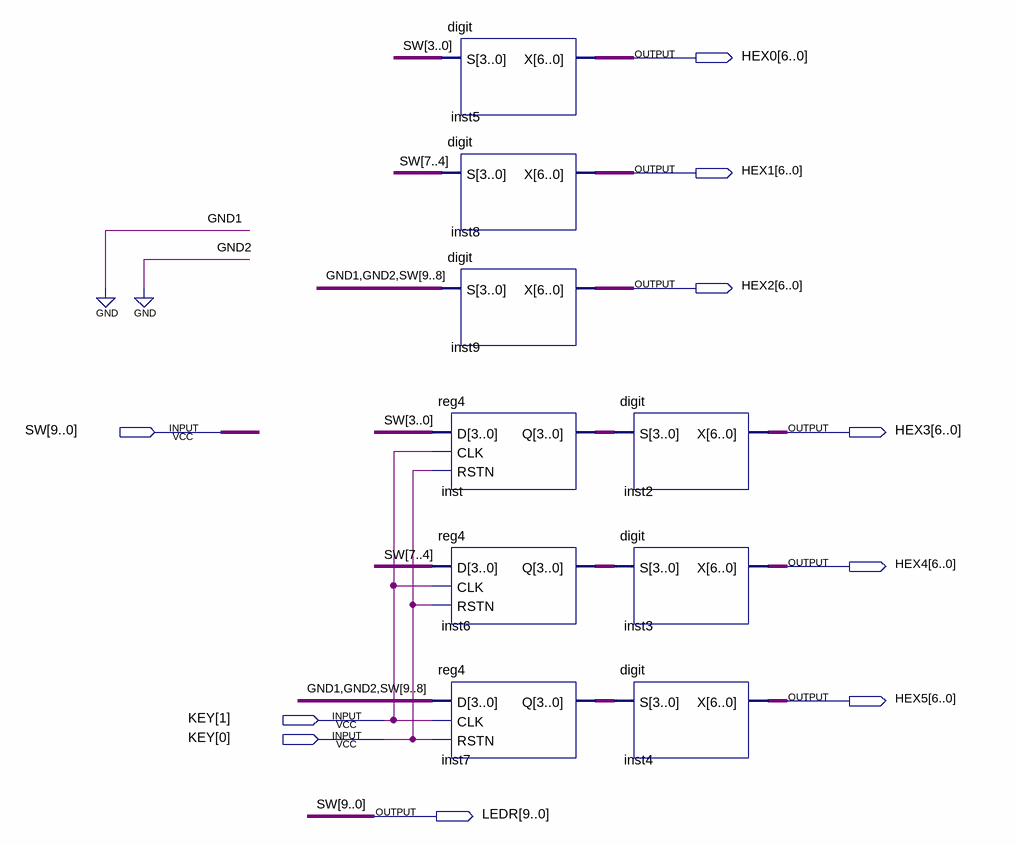
[diagram p0: schematic sheet]
// Quartus schematic part_d.bdf as structural Verilog: 9 symbols, 10 pins
module part_d (
  input  [9:0] SW,
  input  [1:0] KEY,
  output [6:0] HEX0,
  output [6:0] HEX1,
  output [6:0] HEX2,
  output [6:0] HEX3,
  output [6:0] HEX4,
  output [6:0] HEX5,
  output [9:0] LEDR
);

  wire [3:0] inst6_q, inst7_q, inst_q;

  digit inst5 (.S(SW[3:0]), .X(HEX0));
  digit inst8 (.S(SW[7:4]), .X(HEX1));
  digit inst9 (.S({2'b00, SW[9:8]}), .X(HEX2));
  reg4 inst (.D(SW[3:0]), .CLK(KEY[1]), .RSTN(KEY[0]), .Q(inst_q));
  reg4 inst6 (.D(SW[7:4]), .CLK(KEY[1]), .RSTN(KEY[0]), .Q(inst6_q));
  reg4 inst7 (.D({2'b00, SW[9:8]}), .CLK(KEY[1]), .RSTN(KEY[0]), .Q(inst7_q));
  digit inst2 (.S(inst_q), .X(HEX3));
  digit inst3 (.S(inst6_q), .X(HEX4));
  digit inst4 (.S(inst7_q), .X(HEX5));

  assign LEDR = SW;
endmodule
